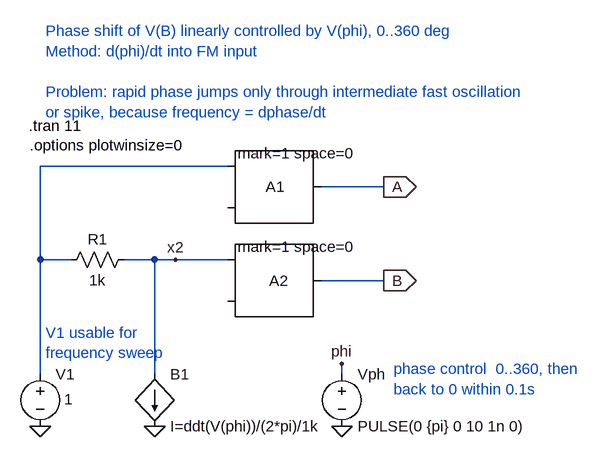
[diagram p0: schematic ctrl_phase_shift_2.asc]
ctrl_phase_shift_2.asc, the LTspice schematic file:
Version 4
SHEET 1 1088 680
WIRE -144 176 -144 32
WIRE -144 352 -144 176
WIRE -96 176 -144 176
WIRE 32 176 -16 176
WIRE 32 352 32 176
WIRE 64 176 32 176
WIRE 144 32 -144 32
WIRE 144 176 64 176
WIRE 320 352 320 336
WIRE 384 64 288 64
WIRE 384 208 288 208
FLAG -144 432 0
FLAG 384 64 A
IOPIN 384 64 Out
FLAG 384 208 B
IOPIN 384 208 Out
FLAG 320 432 0
FLAG 320 336 phi
FLAG 32 432 0
FLAG 64 176 x2
SYMBOL voltage -144 336 R0
WINDOW 123 0 0 Left 0
WINDOW 39 0 0 Left 0
WINDOW 3 37 55 Left 0
SYMATTR Value 1
SYMATTR InstName V1
SYMBOL voltage 320 336 R0
WINDOW 123 0 0 Left 0
WINDOW 39 0 0 Left 0
SYMATTR InstName Vph
SYMATTR Value PULSE(0 {pi} 0 10 1n 0)
SYMBOL SpecialFunctions\\modulate 144 32 R0
WINDOW 3 16 -20 Left 0
WINDOW 0 59 32 Left 0
SYMATTR Value mark=1 space=0
SYMATTR InstName A1
SYMBOL SpecialFunctions\\modulate 144 176 R0
WINDOW 3 16 -20 Left 0
WINDOW 0 64 32 Left 0
SYMATTR Value mark=1 space=0
SYMATTR InstName A2
SYMBOL res -112 192 R270
WINDOW 0 32 56 VTop 0
WINDOW 3 0 56 VBottom 0
SYMATTR InstName R1
SYMATTR Value 1k
SYMBOL bi 32 352 R0
SYMATTR InstName B1
SYMATTR Value I=ddt(V(phi))/(2*pi)/1k
TEXT -162 -30 Left 0 !.tran 11
TEXT -160 0 Left 0 !.options plotwinsize=0
TEXT -136 -176 Left 0 ;Phase shift of V(B) linearly controlled by V(phi), 0..360 deg\nMethod: d(phi)/dt into FM input\n \nProblem: rapid phase jumps only through intermediate fast oscillation\nor spike, because frequency = dphase/dt
TEXT 400 344 Left 0 ;phase control  0..360, then\nback to 0 within 0.1s
TEXT -136 288 Left 0 ;V1 usable for\nfrequency sweep

The netlist it stands for:
* ctrl_phase_shift_2.asc
V1 N001 0 1
Vph phi 0 PULSE(0 {pi} 0 10 1n 0)
A1 N001 0 0 0 0 0 A 0 MODULATOR mark=1 space=0
A2 x2 0 0 0 0 0 B 0 MODULATOR mark=1 space=0
R1 N001 x2 1k
B1 x2 0 I=ddt(V(phi))/(2*pi)/1k
.tran 11
.options plotwinsize=0
* Phase shift of V(B) linearly controlled by V(phi), 0..360 deg
* Method: d(phi)/dt into FM input
* Problem: rapid phase jumps only through intermediate fast oscillation
* or spike, because frequency = dphase/dt
* phase control  0..360, then
* back to 0 within 0.1s
* V1 usable for
* frequency sweep
.backanno
.end